# EAGLE design detector ne602 v2 (EAGLE 9.1.2)
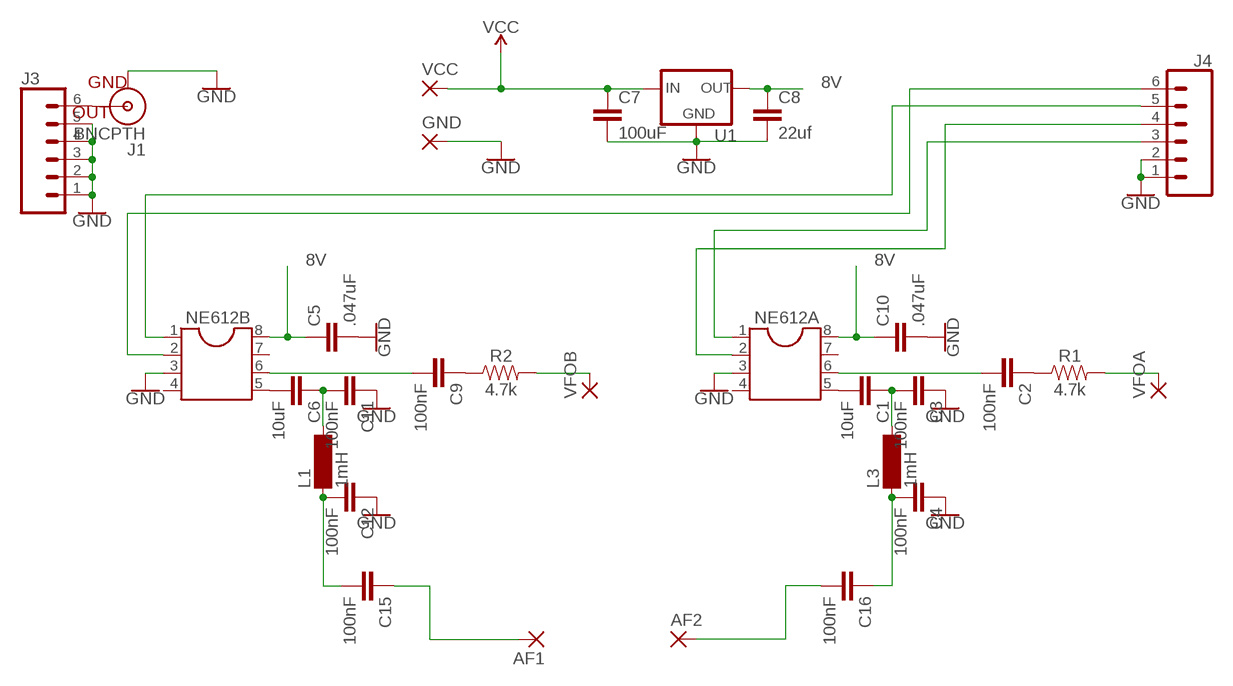
[diagram p0: schematic, sheet 1]

## Parts
AF1  3,17/1,1  [3,17/1,1]
AF2  3,17/1,1  [3,17/1,1]
C1  10uF  C5/3.5  [C5B3.5]
C2  100nF  C5/3.5  [C5B3.5]
C3  100nF  C5/3.5  [C5B3.5]
C4  100nF  C5/3.5  [C5B3.5]
C5  .047uF  C5/3.5  [C5B3.5]
C6  10uF  C5/3.5  [C5B3.5]
C7  100uF  C5/3.5  [C5B3.5]
C8  22uf  C5/3.5  [C5B3.5]
C9  100nF  C5/3.5  [C5B3.5]
C10  .047uF  C5/3.5  [C5B3.5]
C11  100nF  C5/3.5  [C5B3.5]
C12  100nF  C5/3.5  [C5B3.5]
C15  100nF  C5/3.5  [C5B3.5]
C16  100nF  C5/3.5  [C5B3.5]
GND  3,17/1,1  [3,17/1,1]
J1  BNCPTH  [BNC]
J3  CONN_06SILK_FEMALE_PTH  [1X06]
J4  CONN_06SILK_FEMALE_PTH  [1X06]
L1  1mH  BS75  [BS75]
L3  1mH  BS75  [BS75]
NE612A  DIL8  [DIL08]
NE612B  DIL8  [DIL08]
R1  4.7k  1KOHM-HORIZ-1/4W-1%  [AXIAL-0.3]
R2  4.7k  1KOHM-HORIZ-1/4W-1%  [AXIAL-0.3]
U1  V_REG_78XXTO-92_UNTESTED  [TO-92]
VCC  3,17/1,1  [3,17/1,1]
VFOA  3,17/1,1  [3,17/1,1]
VFOB  3,17/1,1  [3,17/1,1]

## Nets
8V: C5.1 C8.1 C10.1 NE612A.8 NE612B.8 U1.1(OUT)
GND: C3.1 C4.1 C5.2 C7.2 C8.2 C10.2 C11.1 C12.1 GND.1(P) J1.GND J3.1 J3.2 J3.3 J3.4 J3.5 J4.1 J4.2 NE612A.3 NE612B.3 U1.2(GND)
N$1: C1.2 NE612A.5
N$2: C2.2 NE612A.6
N$3: C1.1 C3.2 L3.2
N$4: C4.2 C16.1 L3.1
N$5: C2.1 R1.P$1
N$6: R1.P$2 VFOA.1(P)
N$7: J4.5 NE612B.1
N$8: C6.2 NE612B.5
N$9: C9.2 NE612B.6
N$10: C6.1 C11.2 L1.2
N$11: C12.2 C15.2 L1.1
N$12: C9.1 R2.P$1
N$13: R2.P$2 VFOB.1(P)
N$14: J4.6 NE612B.2
N$15: J4.3 NE612A.1
N$16: J4.4 NE612A.2
N$17: AF1.1(P) C15.1
N$18: AF2.1(P) C16.2
N$19: J1.S(OUT) J3.6
VCC: C7.1 U1.3(IN) VCC.1(P)
Unconnected: NE612A.4 NE612A.7 NE612B.4 NE612B.7

## Library data of the parts
AF1 AF2 GND VCC VFOA VFOB = wirepad:3,17/1,1: THROUGH-HOLE PAD
C1-C12 C15 C16 = capacitor-wima:C: CAPACITOR naming: grid - package width
J1 = SparkFun-Connectors:BNC: BNC Right Angle Connector Mouser Part# 5227161 SparkFun Products: BNC Connector - Right Angle <https://www.sparkfun.com/products/10550>; PROD_ID: LPA-12729; SF_ID: PRT-10550
J3 J4 = SparkFun-Connectors:CONN_06: Multi connection point. Often used as Generic Header-pin footprint for 0.1 inch spaced/style header connections On any of the 0.1 inch spaced packages, you can populate with these: Break Away Headers - Straight <https://www.sparkfun.com/products/116> (PRT-00116) Break Away Male Headers - Right Angle <https://www.sparkfun.com/products/553> (PRT-00553) Female Headers <https://www.sparkfun.com/products/115> (PRT-00115) Break Away Headers - Machine Pin <https://www.sparkfun.com/products/117> (PRT-00117) Break Away Female Headers - Swiss Machine Pin <https://www.sparkfun.com/products/743> (PRT-00743) Arduino Stackable Header - 6 Pin <https://www.sparkfun.com/products/9280> (PRT-09280) For SCREWTERMINALS and SPRING TERMINALS visit here: Screw Terimnals on SparkFun.com <https://www.sparkfun.com/search/results?term=Screw+Terminals> (5mm/3.5mm/2.54mm spacing) This device is also useful as a general connection point to wire up your design to another part of your project. Our various solder wires solder well into these plated through hole pads. Hook-Up Wire - Assortment (Stranded, 22 AWG) <https://www.sparkfun.com/products/11375> (PRT-11375) Hook-Up Wire - Assortment (Solid Core, 22 AWG) <https://www.sparkfun.com/products/11367> (PRT-11367) View the entire wire category on our website here <https://www.sparkfun.com/categories/141>; PROD_ID: CONN-08437
L1 L3 = inductor-neosid:BS: INDUCTOR nominal inductance, magnetically screened; OC_FARNELL: unknown; OC_NEWARK: unknown
NE612A NE612B = ic-package:DIL8: Dual In Line / Socket
R1 R2 = SparkFun-Resistors:1KOHM: 1kΩ resistor A resistor is a passive two-terminal electrical component that implements electrical resistance as a circuit element. Resistors act to reduce current flow, and, at the same time, act to lower voltage levels within circuits. - Wikipedia; PROD_ID: RES-12182; VALUE: 1k
U1 = SparkFun-IC-Power:V_REG_78XX: Voltage Regulator Standard 78xx regulator. IGO (Input Ground Output). Spark Fun Electronics SKU : COM-00107

## Net classes
0 default: width 0.762 mm, drill 0.762 mm, clearance 0.508 mm

## Board
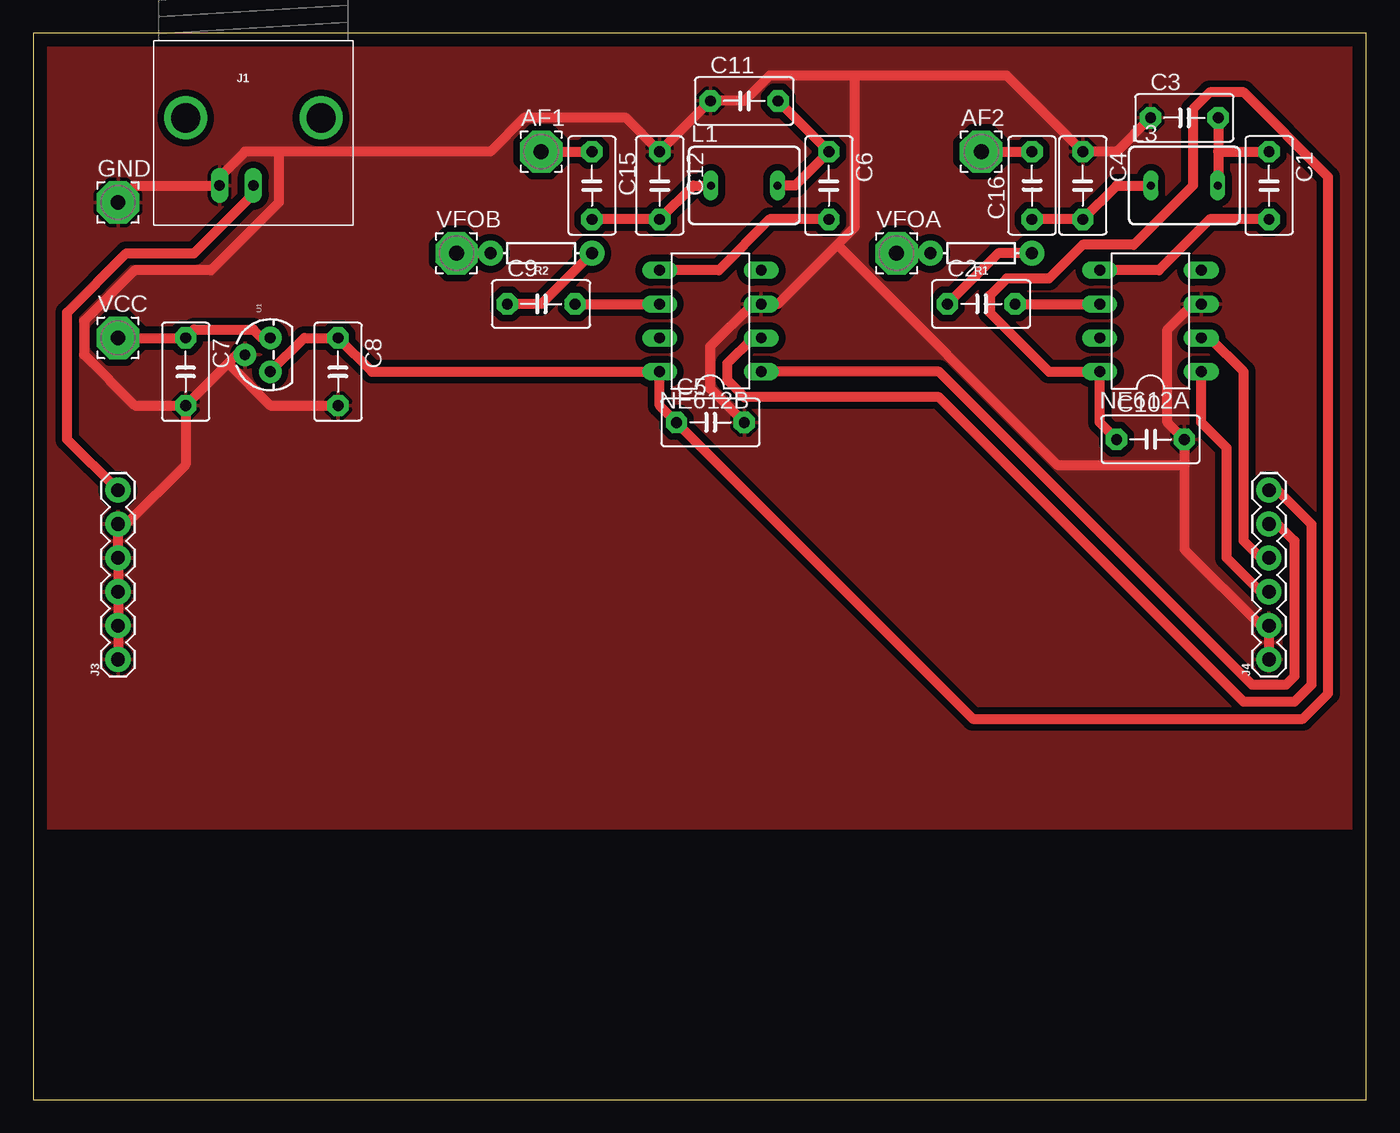
[diagram p1: board, top side]

Size 100 x 80 mm. Coordinates in mm from the lower left corner, seen from the top.
Outline: 0,0 100,0 100,80 0,80 0,0
Copper layers (1*16): Top 0.035mm / dielectric 1.5mm / Bottom 0.035mm
Design rules "default": minimum track width 6mil, minimum drill 0.35mm, track to track 6mil, track to pad 6mil, pad to pad 6mil, via to via 6mil, smd to smd 6mil, copper to edge 40mil, drill to drill 6mil, minimum pad ring 10mil, minimum via ring 8mil, stop-mask expansion 4mil, vias tented up to drill 0mil, thermal gap 10mil

### Footprints (pad centres in the part's own frame; a part is rotated, then mirrored left to right if it is on the bottom)
3,17/1,1 = drill 1.118 pad 3.175 octagon: 1 0,0
C5B3.5 = drill 0.813 pad 1.6 octagon: 1 -2.54,0; 2 2.54,0
BNC = drill 2.2: 3 -5.08,5.08; 4 5.08,5.08 | drill 0.8 long: GND -2.54,0; S 0,0
1X06 = drill 1.016 pad 1.88: 1 0,0; 2 2.54,0; 3 5.08,0; 4 7.62,0; 5 10.16,0; 6 12.7,0
BS75 = drill 0.6 long: 1 -2.5,0; 2 2.5,0
DIL08 = drill 0.813 long: 1 -3.81,-3.81; 2 -1.27,-3.81; 3 1.27,-3.81; 4 3.81,-3.81; 5 3.81,3.81; 6 1.27,3.81; 7 -1.27,3.81; 8 -3.81,3.81
AXIAL-0.3 = drill 0.9 pad 1.88: P$1 -3.81,0; P$2 3.81,0
TO-92 = drill 0.813 pad 1.676: 1 -1.27,0; 2 0,1.905; 3 1.27,0

### Placement (x,y rotation side)
AF1  38.1,71.12 0 top
AF2  71.12,71.12 0 top
C1  92.71,68.58 270 top
C2  71.12,59.69 0 top
C3  86.36,73.66 0 top
C4  78.74,68.58 270 top
C5  50.8,50.8 0 top
C6  59.69,68.58 270 top
C7  11.43,54.61 270 top
C8  22.86,54.61 270 top
C9  38.1,59.69 0 top
C10  83.82,49.53 0 top
C11  53.34,74.93 0 top
C12  46.99,68.58 270 top
C15  41.91,68.58 270 top
C16  74.93,68.58 90 top
GND  6.35,67.31 0 top
J1  16.51,68.58 0 top
J3  6.35,33.02 90 top
J4  92.71,33.02 90 top
L1  53.34,68.58 0 top
L3  86.36,68.58 0 top
NE612A  83.82,58.42 90 top
NE612B  50.8,58.42 90 top
R1  71.12,63.5 180 top
R2  38.1,63.5 180 top
U1  17.78,55.88 90 top
VCC  6.35,57.15 0 top
VFOA  64.77,63.5 0 top
VFOB  31.75,63.5 0 top

### Tracks (layer width: path | path; a pad name or v marks a point on that pad's centre or on a via)
8V
  Top 0.762: C10.1 80.01,50.8 NE612A.8 76.2,54.61 71.75,59.05 71.75,60.33 73.03,61.59 76.2,61.59 78.74,64.14 82.55,64.14 87,68.58 87,74.3 88.27,75.56 90.81,75.56 97.16,69.22 97.16,30.48 95.25,28.57 70.48,28.57 C5.1 46.99,52.07 NE612B.8 25.4,54.61 C8.1 20.32,57.15 U1.1
GND
  Top 0.762: J3.1 J3.2 J3.3 J3.4 J3.5 6.99,43.18 11.43,47.62 C7.2 | 14.61,55.24 15.24,55.88 U1.2 | 14.61,55.24 C7.2 | C8.2 17.78,52.07 14.61,55.24 | J4.1 J4.2 92.08,35.56 86.36,41.27 86.36,47.62 | NE612A.3 87,59.69 85.09,57.78 85.09,50.8 C10.2 86.36,47.62 | GND.1 7.62,68.58 J1.GND 13.97,69.22 15.88,71.12 18.41,71.12 | C5.2 50.8,53.34 50.8,56.52 53.98,59.69 NE612B.3 55.88,59.69 60.33,64.14 | C3.1 81.28,71.12 C4.1 73.03,76.83 61.59,76.83 | 61.59,76.83 55.24,76.83 53.34,74.93 C11.1 C12.1 44.45,73.66 36.83,73.66 34.29,71.12 18.41,71.12 | 60.33,64.14 61.59,65.41 61.59,76.83 | 86.36,47.62 76.83,47.62 60.33,64.14 | C7.2 7.62,52.07 3.81,55.88 3.81,58.42 7.62,62.23 13.34,62.23 18.41,67.31 18.41,71.12
  pour Top: 0,80.01 100.33,80.01 100.33,20.32 0,20.32
N$1
  Top 0.762: NE612A.5 84.45,62.23 88.27,66.04 C1.2
N$2
  Top 0.762: C2.2 NE612A.6
N$3
  Top 0.762: C3.2 88.9,71.12 | 88.9,71.12 88.9,68.58 L3.2 | 88.9,71.12 C1.1
N$4
  Top 0.762: L3.1 83.82,68.58 81.28,68.58 C4.2 C16.1
N$5
  Top 0.762: C2.1 72.39,63.5 R1.P$1
N$6
  Top 0.762: VFOA.1 R1.P$2
N$7
  Top 0.762: NE612B.1 67.94,54.61 91.44,31.11 93.98,31.11 94.61,31.75 94.61,41.91 93.34,43.18 J4.5
N$8
  Top 0.762: NE612B.5 51.44,62.23 55.24,66.04 C6.2
N$9
  Top 0.762: C9.2 NE612B.6
N$10
  Top 0.762: L1.2 55.88,68.58 57.15,68.58 C6.1 C11.2
N$11
  Top 0.762: L1.1 50.8,68.58 49.53,68.58 C12.2 C15.2
N$12
  Top 0.762: C9.1 38.1,59.69 R2.P$1
N$13
  Top 0.762: VFOB.1 R2.P$2
N$14
  Top 0.762: NE612B.2 53.98,57.15 52.07,55.24 52.07,53.98 53.34,52.7 67.94,52.7 90.81,29.84 94.61,29.84 95.89,31.11 95.89,43.18 93.34,45.72 J4.6
N$15
  Top 0.762: NE612A.1 87.63,50.8 89.53,48.9 89.53,40.64 92.08,38.1 J4.3
N$16
  Top 0.762: NE612A.2 88.27,57.15 90.81,54.61 90.81,41.91 92.08,40.64 J4.4
N$17
  Top 0.762: AF1.1 C15.1
N$18
  Top 0.762: AF2.1 C16.2
N$19
  Top 0.762: J1.S 16.51,67.94 12.06,63.5 6.99,63.5 2.54,59.05 2.54,49.53 J3.6
VCC
  Top 0.762: VCC.1 C7.1 12.06,57.78 16.51,57.78 17.14,57.15 U1.3